# Altium schematic sheet Sheet3.SchDoc
size A4; SheetNumber: 3; SheetTotal: 6
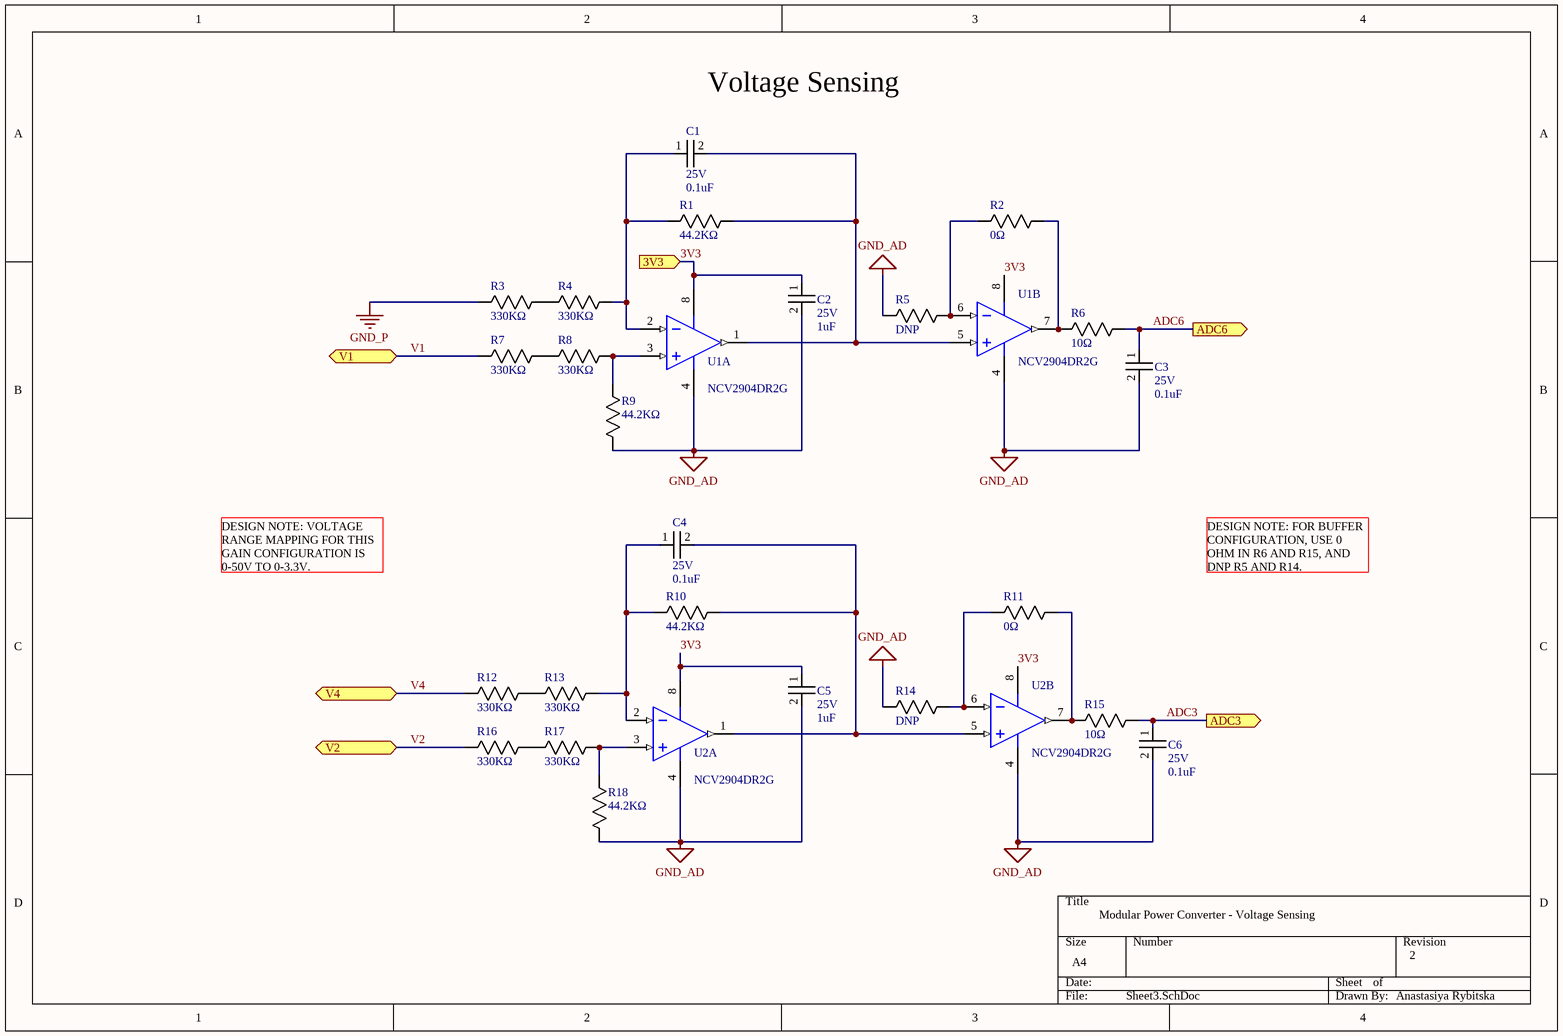
[diagram p0: Sheet3.SchDoc]

## Parts
C1  Voltage Rating: 25V  Capacitance: 0.1uF  [0603]  (hidden comment: CC0603MRX7R8BB104)
C2  Voltage Rating: 25V  Capacitance: 1uF  [0603]  (hidden comment: CL10B105KA8NFNC)
C3  Voltage Rating: 25V  Capacitance: 0.1uF  [0603]  (hidden comment: CC0603MRX7R8BB104)
C4  Voltage Rating: 25V  Capacitance: 0.1uF  [0603]  (hidden comment: CC0603MRX7R8BB104)
C5  Voltage Rating: 25V  Capacitance: 1uF  [0603]  (hidden comment: CL10B105KA8NFNC)
C6  Voltage Rating: 25V  Capacitance: 0.1uF  [0603]  (hidden comment: CC0603MRX7R8BB104)
R1  Resistance: 44.2KΩ  [0603]  (hidden comment: RT0603FRE0744K2L)
R2  Resistance: 0Ω  [0603]  (hidden comment: AC0603FR-070RL)
R3  Resistance: 330KΩ  [0603]  (hidden comment: ERJ3EKF3303V)
R4  Resistance: 330KΩ  [0603]  (hidden comment: ERJ3EKF3303V)
R5  Resistance: DNP  [0603]  (hidden comment: AC0603FR-070RL)
R6  Resistance: 10Ω  [0603]  (hidden comment: RMCF0603JT10R0)
R7  Resistance: 330KΩ  [0603]  (hidden comment: ERJ3EKF3303V)
R8  Resistance: 330KΩ  [0603]  (hidden comment: ERJ3EKF3303V)
R9  Resistance: 44.2KΩ  [0603]  (hidden comment: RT0603FRE0744K2L)
R10  Resistance: 44.2KΩ  [0603]  (hidden comment: RT0603FRE0744K2L)
R11  Resistance: 0Ω  [0603]  (hidden comment: AC0603FR-070RL)
R12  Resistance: 330KΩ  [0603]  (hidden comment: ERJ3EKF3303V)
R13  Resistance: 330KΩ  [0603]  (hidden comment: ERJ3EKF3303V)
R14  Resistance: DNP  [0603]  (hidden comment: AC0603FR-070RL)
R15  Resistance: 10Ω  [0603]  (hidden comment: RMCF0603JT10R0)
R16  Resistance: 330KΩ  [0603]  (hidden comment: ERJ3EKF3303V)
R17  Resistance: 330KΩ  [0603]  (hidden comment: ERJ3EKF3303V)
R18  Resistance: 44.2KΩ  [0603]  (hidden comment: RT0603FRE0744K2L)
U1  NCV2904DR2G  [ONSC-SOIC-8-751-07_V]  (parts A,B of 2)
U2  NCV2904DR2G  [ONSC-SOIC-8-751-07_V]  (parts A,B of 2)

## Ports
3V3 (in), ADC3 (out), ADC6 (out), V1 (bidir), V2 (bidir), V4 (bidir)

## Nets
GND_AD: C2.2 C3.2 C5.2 C6.2 R5.1 R9.1 R14.1 R18.1 U1.4(VEE/GND) U2.4(VEE/GND)
GND_P: R3.1
3V3: C2.1 C5.1 U1.8(VCC) U2.8(VCC) ; port 3V3
ADC3: C6.1 R15.2 ; port ADC3
ADC6: C3.1 R6.2 ; port ADC6
V1: R7.1 ; port V1
V2: R16.1 ; port V2
V4: R12.1 ; port V4
NetC1_1: C1.1 R1.1 R4.2 U1.2(INA-)
NetC1_2: C1.2 R1.2 U1.1(OUTA) U1.5(INB+)
NetC4_1: C4.1 R10.1 R13.2 U2.2(INA-)
NetC4_2: C4.2 R10.2 U2.1(OUTA) U2.5(INB+)
NetR2_1: R2.1 R5.2 U1.6(INB-)
NetR2_2: R2.2 R6.1 U1.7(OUTB)
NetR3_2: R3.2 R4.1
NetR7_2: R7.2 R8.1
NetR8_2: R8.2 R9.2 U1.3(INA+)
NetR11_1: R11.1 R14.2 U2.6(INB-)
NetR11_2: R11.2 R15.1 U2.7(OUTB)
NetR12_2: R12.2 R13.1
NetR16_2: R16.2 R17.1
NetR17_2: R17.2 R18.2 U2.3(INA+)

## Notes on the sheet
- Voltage Sensing
- DESIGN NOTE: VOLTAGE RANGE MAPPING FOR THIS GAIN CONFIGURATION IS 0-50V TO 0-3.3V.
- DESIGN NOTE: FOR BUFFER CONFIGURATION, USE 0 OHM IN R6 AND R15, AND DNP R5 AND R14.
- Modular Power Converter - Voltage Sensing
- 2
- Anastasiya Rybitska

## Library data of the parts
C1 C3 C4 C6 = CC0603MRX7R8BB104: CAP CER 0.1UF 25V X7R 0603
C2 C5 = CL10B105KA8NFNC: Cap Ceramic 1uF 25V X7R ±10% Pad SMD 0603 +125°C T/R
R1 R9 R10 R18 = RT0603FRE0744K2L: RES SMD 44.2K OHM 1% 1/10W 0603
R2 R5 R11 R14 = AC0603FR-070RL: RES SMD 0 OHM JUMPER 1/10W 0603
R6 R15 = RMCF0603JT10R0: RES 10 OHM 5% 1/10W 0603
U1 U2 = CMP-1310-00228-1: Single Supply Dual Operational Amplifier, 3 to 32 V, -40 to 125 degC, 8-Pin SOIC, Pb-Free, Tape and Reel; Manufacturer: On Semiconductor; VCC Min (V): 3; VCC Max (V): 32; DatasheetVersion: Rev. 27; ComponentLink2URL: http://www.onsemi.cn/pub_link/Collateral/LM358-D.PDF; Mounting Technology: Surface Mount; PackageReference: SOIC-8-751-07; PartNumber: NCV2904DR2G; ComponentLink1Description: Manufacturer URL; ComponentLink2Description: Datasheet; ComponentLink3Description: Package Specification; RoHS: TRUE; PackageDescription: 8-Pin Small Outline Integrated Circuit, Body 4.9 x 3.9 mm, Pitch 1.27 mm; ComponentLink3URL: http://www.onsemi.com/pub_link/Collateral/751-07.PDF; PackageVersion: Rev. AK, 02/2011; ComponentLink1URL: http://www.onsemi.com/; Packing: Tape and Reel